# Altium schematic sheet [0]-Cover Page.SchDoc
size A2
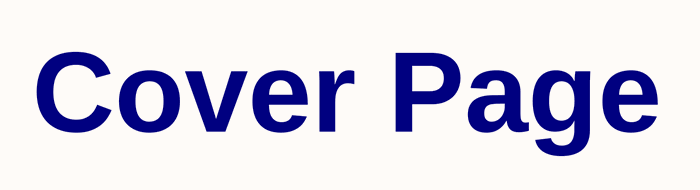
[diagram p0: [0]-Cover Page.SchDoc]

## Notes on the sheet
- Cover Page